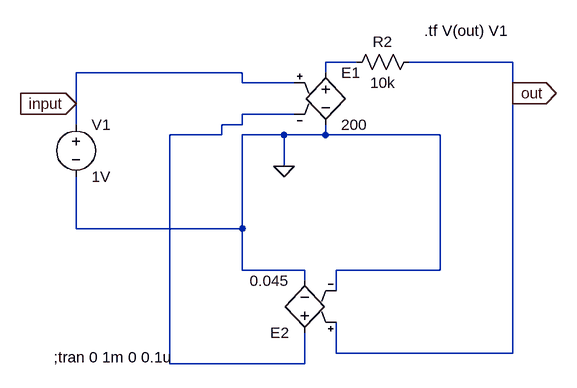
[diagram p0: schematic feedback_amp.asc]
feedback_amp.asc, the LTspice schematic file:
Version 4
SHEET 1 880 680
WIRE 400 0 352 0
WIRE 640 0 480 0
WIRE 224 16 -32 16
WIRE 352 16 352 0
WIRE 224 32 224 16
WIRE 304 32 224 32
WIRE 640 48 640 0
WIRE -32 64 -32 16
WIRE 304 80 224 80
WIRE -32 96 -32 64
WIRE 224 96 224 80
WIRE 224 96 192 96
WIRE 192 112 192 96
WIRE 192 112 112 112
WIRE 288 112 224 112
WIRE 352 112 352 96
WIRE 352 112 288 112
WIRE 528 112 352 112
WIRE 288 160 288 112
WIRE -32 256 -32 176
WIRE 224 256 224 112
WIRE 224 256 -32 256
WIRE 224 320 224 256
WIRE 320 320 224 320
WIRE 528 320 528 112
WIRE 528 320 368 320
WIRE 320 336 320 320
WIRE 368 352 368 320
WIRE 368 448 368 400
WIRE 640 448 640 48
WIRE 640 448 368 448
WIRE 112 464 112 112
WIRE 320 464 320 416
WIRE 320 464 112 464
FLAG 288 160 0
FLAG 640 48 out
IOPIN 640 48 Out
FLAG -32 64 input
IOPIN -32 64 In
SYMBOL voltage -32 80 R0
WINDOW 123 0 0 Left 0
WINDOW 39 24 124 Left 2
SYMATTR InstName V1
SYMATTR Value 1V
SYMBOL res 496 -16 R90
WINDOW 0 0 56 VBottom 2
WINDOW 3 32 56 VTop 2
SYMATTR InstName R2
SYMATTR Value 10k
SYMBOL e 352 0 R0
SYMATTR InstName E1
SYMATTR Value 200
SYMBOL e 320 432 R180
SYMATTR InstName E2
SYMATTR Value 0.045
TEXT -66 454 Left 2 !;tran 0 1m 0 0.1u
TEXT 504 -48 Left 2 !.tf V(out) V1

The netlist it stands for:
* feedback_amp.asc
V1 input 0 1V
R2 out N001 10k
E1 N001 0 input N002 200
E2 N002 0 out 0 0.045
;tran 0 1m 0 0.1u
.tf V(out) V1
.backanno
.end